# EAGLE design ESP32_adapter_revA (EAGLE 7.3.0)
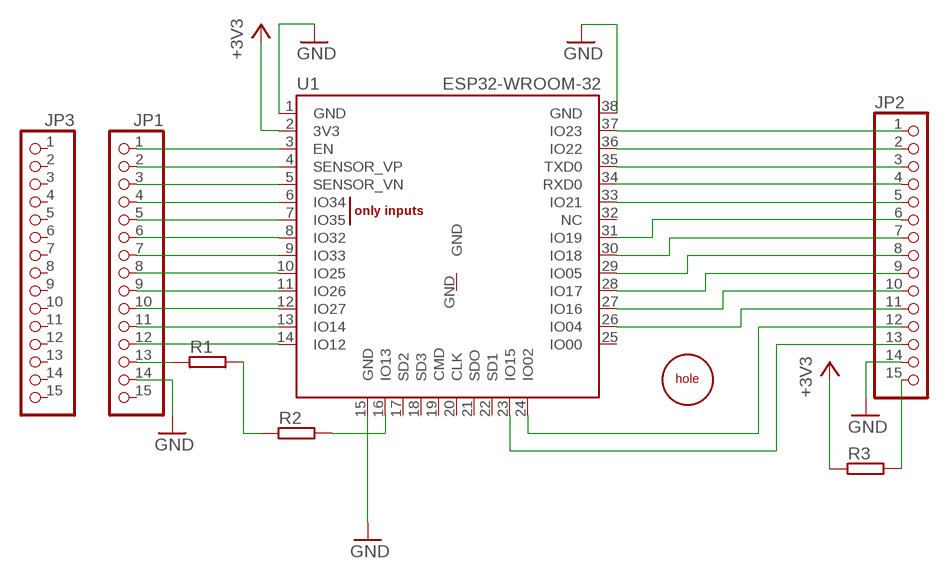
[diagram p0: schematic, sheet 1]

## Parts
JP1  PINHD-1X15  [1X15]
JP2  PINHD-1X15  [1X15]
JP3  PINHD-1X15  [1X15]
R1  R'2'  [R0805]
R2  R'2'  [R0805]
R3  R'2'  [R0805]
U1  ESP-WROOM-32  [ESP-WROOM-32]
U$1  HOLE  [HOLE]

## Nets
+3V3: R3.1 U1.2(3V3)
GND: JP1.14 JP2.14 U1.1(GND) U1.15(GND) U1.38(GND)
N$1: JP1.1 U1.3(EN)
N$2: R2.2 U1.16(IO13)
N$3: JP1.2 U1.4(SENSOR_VP)
N$4: JP1.3 U1.5(SENSOR_VN)
N$5: JP1.4 U1.6(IO34)
N$6: JP1.5 U1.7(IO35)
N$7: JP1.6 U1.8(IO32)
N$8: JP1.7 U1.9(IO33)
N$9: JP1.8 U1.10(IO25)
N$10: JP1.9 U1.11(IO26)
N$11: JP1.10 U1.12(IO27)
N$12: JP1.11 U1.13(IO14)
N$13: JP1.12 U1.14(IO12)
N$14: JP1.13 R1.1
N$15: JP2.1 U1.37(IO23)
N$16: JP2.2 U1.36(IO22)
N$17: JP2.3 U1.35(TXD0)
N$18: JP2.4 U1.34(RXD0)
N$19: JP2.5 U1.33(IO21)
N$20: JP2.6 U1.31(IO19)
N$21: JP2.7 U1.30(IO18)
N$22: JP2.8 U1.29(IO05)
N$23: JP2.9 U1.28(IO17)
N$24: JP2.10 U1.27(IO16)
N$25: JP2.11 U1.26(IO04)
N$26: JP2.12 U1.24(IO02)
N$27: JP2.13 U1.23(IO15)
N$28: R1.2 R2.1
N$29: JP2.15 R3.2
Unconnected: JP1.15 JP3.1 JP3.2 JP3.3 JP3.4 JP3.5 JP3.6 JP3.7 JP3.8 JP3.9 JP3.10 JP3.11 JP3.12 JP3.13 JP3.14 JP3.15 U1.17(SD2) U1.18(SD3) U1.19(CMD) U1.20(CLK) U1.21(SDO) U1.22(SD1) U1.25(IO00) U1.32(NC) U1.GND

## Library data of the parts
JP1-JP3 = 1_domaci:PINHD-1X15: PIN HEADER
R1-R3 = 1_domaci:R
U1 = 1_domaci:ESP-WROOM-32
U$1 = 1_domaci:HOLE

## Board
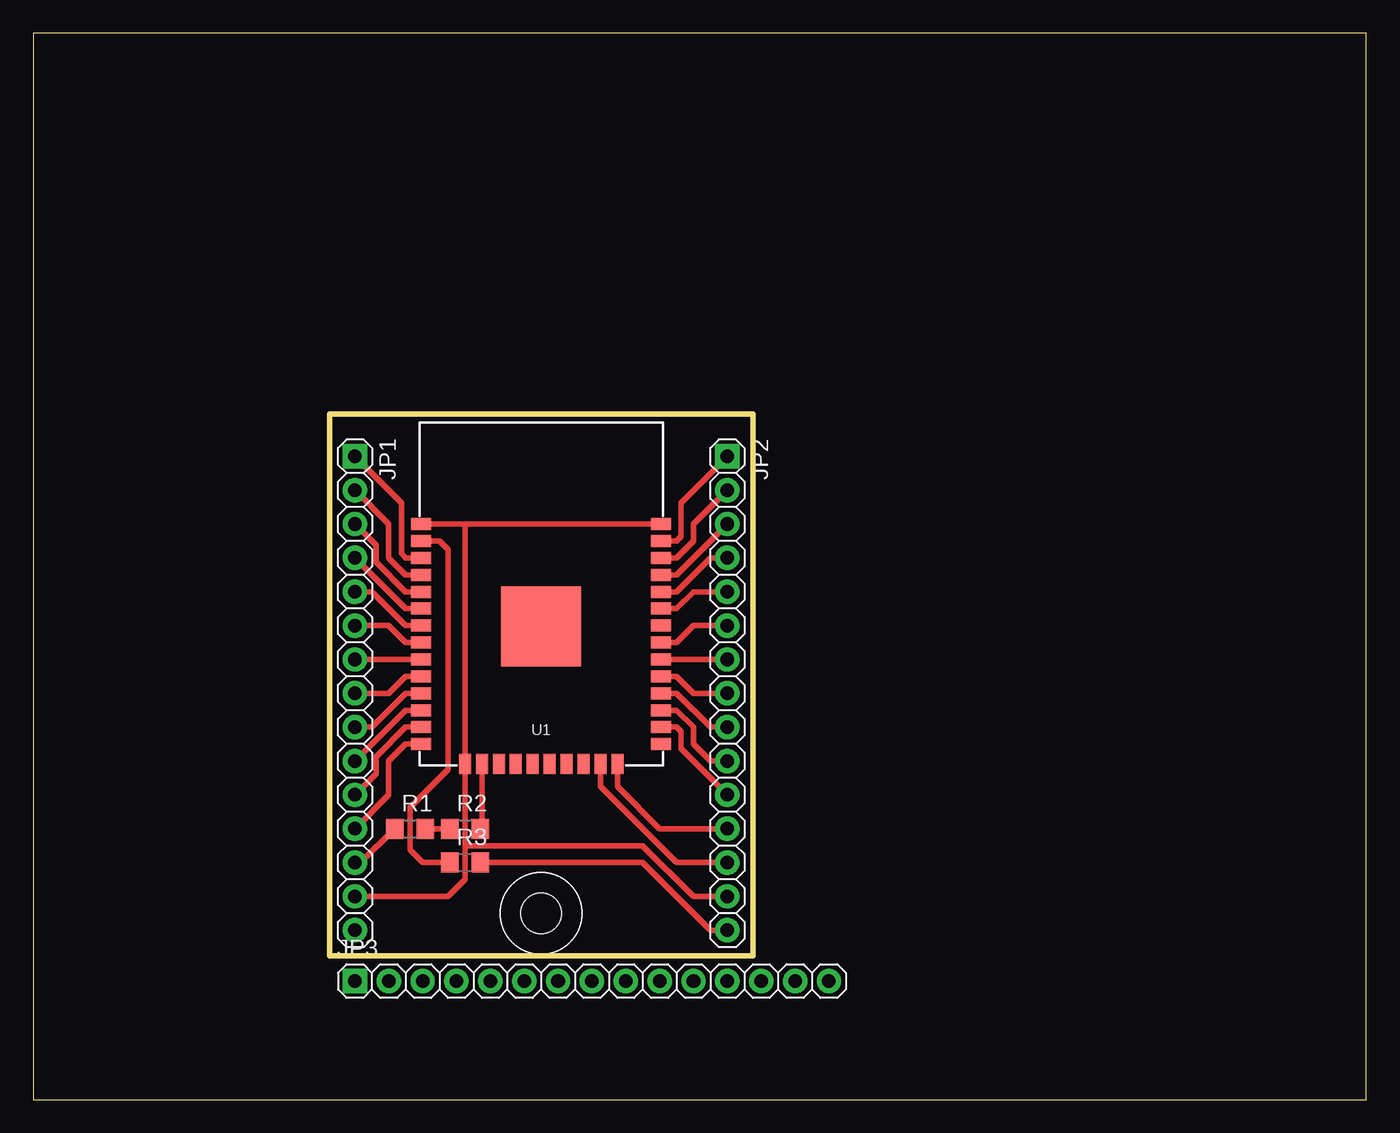
[diagram p1: board, top side]

Size 100 x 80 mm. Coordinates in mm from the lower left corner, seen from the top.
Outline: 0,0 100,0 100,80 0,80 0,0
Outline: 22.23,51.44 53.98,51.44 53.98,10.79 22.23,10.79 22.23,51.44
Copper layers (1*16): Top 0.035mm / dielectric 1.5mm / Bottom 0.035mm
Design rules "default *": minimum track width 10mil, minimum drill 24mil, track to track 8mil, track to pad 8mil, pad to pad 8mil, via to via 8mil, smd to smd 8mil, copper to edge 40mil, drill to drill 8mil, minimum pad ring 10mil, minimum via ring 8mil, stop-mask expansion 4mil, vias tented up to drill 0mil, thermal gap 10mil

### Footprints (pad centres in the part's own frame; a part is rotated, then mirrored left to right if it is on the bottom)
1X15 = drill 1.016 square: 1 -17.78,0 | drill 1.016: 2 -15.24,0; 3 -12.7,0; 4 -10.16,0; 5 -7.62,0; 6 -5.08,0; 7 -2.54,0; 8 0,0; 9 2.54,0; 10 5.08,0; 11 7.62,0; 12 10.16,0; 13 12.7,0; 14 15.24,0; 15 17.78,0
R0805 = smd 1.3 x 1.5: 1 -1.143,0; 2 1.143,0
ESP-WROOM-32 = smd 0.9 x 1.5: 1 7.7,9; 2 6.43,9; 3 5.16,9; 4 3.89,9; 5 2.62,9; 6 1.35,9; 7 0.08,9; 8 -1.19,9; 9 -2.46,9; 10 -3.73,9; 11 -5,9; 12 -6.27,9; 13 -7.54,9; 14 -8.81,9; 25 -8.81,-9; 26 -7.54,-9; 27 -6.27,-9; 28 -5,-9; 29 -3.73,-9; 30 -2.46,-9; 31 -1.19,-9; 32 0.08,-9; 33 1.35,-9; 34 2.62,-9; 35 3.89,-9; 36 5.16,-9; 37 6.43,-9; 38 7.7,-9 | smd 1.5 x 0.9: 15 -10.3,5.715; 16 -10.3,4.445; 17 -10.3,3.175; 18 -10.3,1.905; 19 -10.3,0.635; 20 -10.3,-0.635; 21 -10.3,-1.905; 22 -10.3,-3.175; 23 -10.3,-4.445; 24 -10.3,-5.715 | smd 6 x 6: GND 0,0
HOLE = hole 3.048: 0,0

### Placement (x,y rotation side)
JP1  24.13,30.48 270 top
JP2  52.07,30.48 270 top
JP3  41.91,8.89 0 top
R1  28.26,20.32 0 top
R2  32.38,20.32 0 top
R3  32.38,17.78 0 top
U1  38.1,35.48 90 top
U$1  38.1,13.97 0 top

### Tracks (layer width: path | path; a pad name or v marks a point on that pad's centre or on a via)
+3V3
  Top 0.406: U1.2 30.48,41.91 31.11,41.27 31.11,24.77 28.26,21.91 28.26,18.73 29.21,17.78 R3.1
GND
  Top 0.406: U1.1 32.38,43.18 | 32.38,43.18 U1.38 | 32.38,43.18 U1.15 32.38,19.05 | JP1.14 31.11,15.24 32.38,16.51 32.38,19.05 | JP2.14 49.53,15.24 45.72,19.05 32.38,19.05
N$1
  Top 0.406: U1.3 27.94,40.64 27.62,40.96 27.62,44.77 JP1.1
N$2
  Top 0.406: U1.16 33.66,20.45 R2.2
N$3
  Top 0.406: U1.4 27.94,39.37 26.67,40.64 26.67,43.18 JP1.2
N$4
  Top 0.406: U1.5 27.94,38.1 25.72,40.32 25.72,41.59 JP1.3
N$5
  Top 0.406: JP1.4 27.94,36.83 U1.6
N$6
  Top 0.406: U1.7 27.94,35.56 25.4,38.1 JP1.5
N$7
  Top 0.406: U1.8 27.94,34.29 26.67,35.56 JP1.6
N$8
  Top 0.406: JP1.7 U1.9
N$9
  Top 0.406: U1.10 27.94,31.75 26.67,30.48 JP1.8
N$10
  Top 0.406: U1.11 27.94,30.48 25.4,27.94 JP1.9
N$11
  Top 0.406: U1.12 27.94,29.21 JP1.10
N$12
  Top 0.406: U1.13 27.94,27.94 25.72,25.72 25.72,24.45 JP1.11
N$13
  Top 0.406: U1.14 27.94,26.67 26.67,25.4 26.67,22.86 JP1.12
N$14
  Top 0.406: JP1.13 24.57,17.78 R1.1
N$15
  Top 0.406: U1.37 48.26,41.91 48.58,42.23 48.58,44.77 JP2.1
N$16
  Top 0.406: U1.36 48.26,40.64 49.53,41.91 49.53,43.18 JP2.2
N$17
  Top 0.406: U1.35 48.26,39.37 JP2.3
N$18
  Top 0.406: U1.34 48.26,38.1 50.8,40.64 JP2.4
N$19
  Top 0.406: U1.33 48.26,36.83 49.53,38.1 JP2.5
N$20
  Top 0.406: U1.31 48.26,34.29 49.53,35.56 JP2.6
N$21
  Top 0.406: U1.30 JP2.7
N$22
  Top 0.406: U1.29 48.26,31.75 49.53,30.48 JP2.8
N$23
  Top 0.406: U1.28 48.26,30.48 50.8,27.94 JP2.9
N$24
  Top 0.406: U1.27 48.26,29.21 49.53,27.94 49.53,26.67 50.8,25.4 JP2.10
N$25
  Top 0.406: U1.26 48.26,27.94 48.58,27.62 48.58,26.35 JP2.11
N$26
  Top 0.406: JP2.12 46.99,20.32 43.81,23.5 U1.24
N$27
  Top 0.406: U1.23 42.55,23.5 48.26,17.78 JP2.13
N$28
  Top 0.406: R1.2 R2.1
N$29
  Top 0.406: R3.2 45.72,17.78 50.8,12.7 JP2.15